# Altium schematic sheet supply.SchDoc
size A
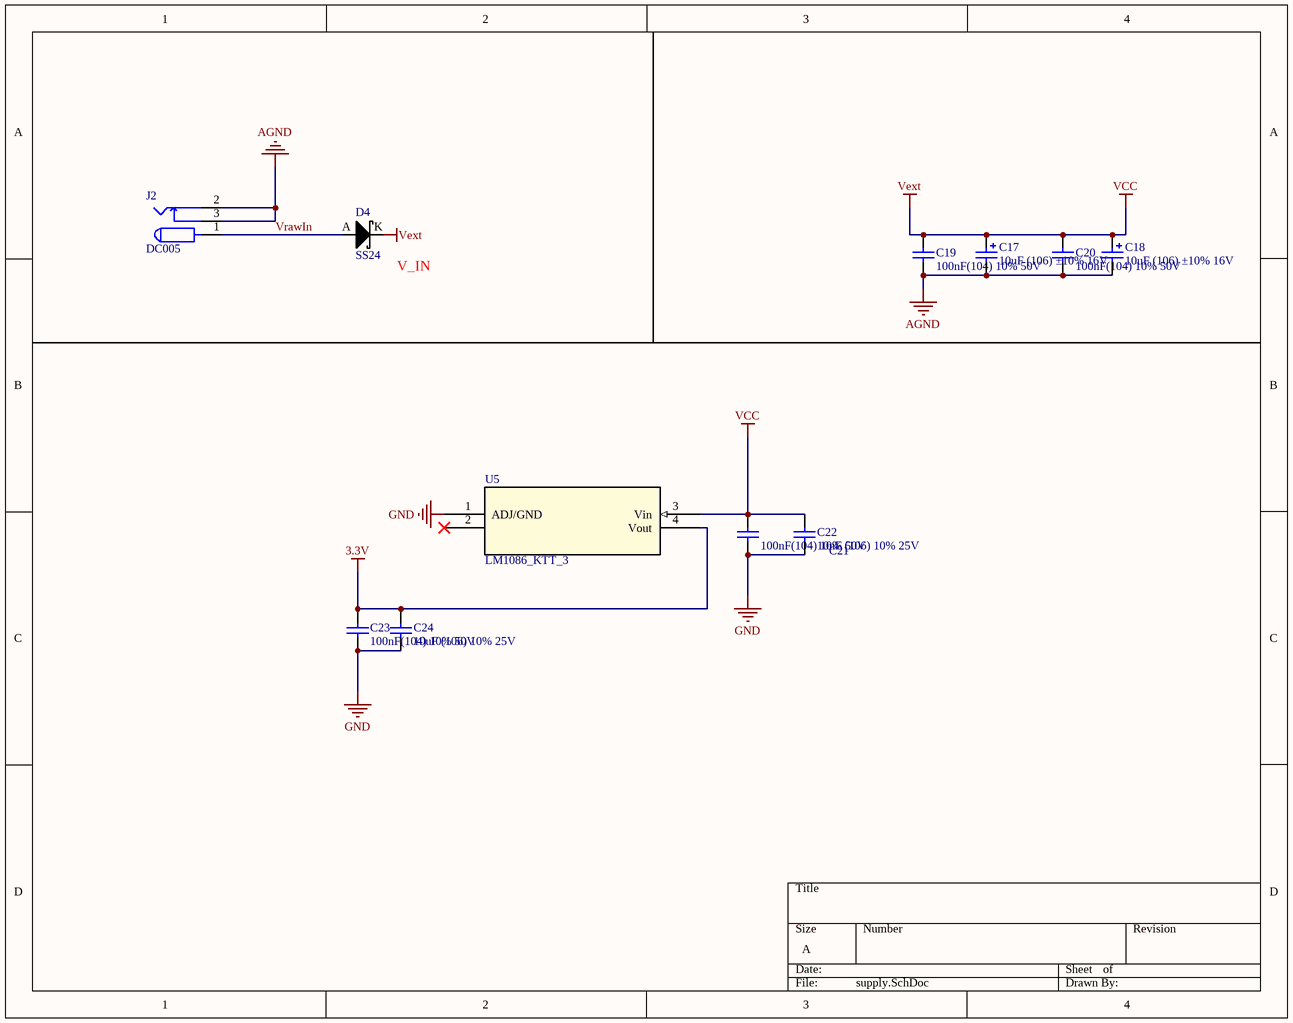
[diagram p0: supply.SchDoc]

## Parts
C17  10uF (106) ±10% 16V  [CASE-A_3216]
C18  10uF (106) ±10% 16V  [CASE-A_3216]
C19  100nF(104) 10% 50V  [0805_C]
C20  100nF(104) 10% 50V  [0805_C]
C21  100nF(104) 10% 50V  [0805_C]
C22  10uF (106) 10% 25V  [0805_C]
C23  100nF(104) 10% 50V  [0805_C]
C24  10uF (106) 10% 25V  [0805_C]
D4  SS24  [SMB-DIODE-DO214AA]
J2  DC005  [DC005]
U5  LM1086_KTT_3  [TS3B]

## Nets
3.3V: C23.1 C24.2 U5.4(Vout)
AGND: C17.2 C18.2 C19.1 C20.1 J2.2 J2.3
GND: C21.1 C22.1 C23.2 C24.1 U5.1(ADJ/GND)
VCC: C17.1 C18.1 C19.2 C20.2 C21.2 C22.2 D4.K U5.3(Vin)  [also labelled Vext]
VrawIn: D4.A J2.1

Not connected (* = marked no-connect by the designer): U5 2(Vout)*

## Notes on the sheet
- (near D4) V_IN

## Library data of the parts
C17 C18 = 3216 10uF (106) 10% 16V: 钽电容; ComponentLink1Description: 供应商链接; ComponentLink1URL: http://www.szlcsc.com/product/details_7643.html; Package: 3216; Supplier: LC; SuppliersPartNumber: C7171
C19-C21 C23 = 0805 100nF(104) 10% 50V: 贴片电容; ComponentLink1Description: 供应商链接; ComponentLink1URL: http://www.szlcsc.com/product/details_50686.html; Package: 0805; Supplier: LC; SuppliersPartNumber: C49678
C22 C24 = 0805 10uF (106) 10% 25V: 贴片电容; ComponentLink1Description: 供应商链接; ComponentLink1URL: http://www.szlcsc.com/product/details_16532.html; Package: 0805; Supplier: LC; SuppliersPartNumber: C15850
D4 = SS24: SCHOTTKY DIODE; Manufacturer: Fairchild Semiconductor; Note: 40V 2A DO214AA; Manufacturer No: SS24; Supplier: LC; PartType: SM; ROHS: True; Pin Count: 2; SuppliersPartNumber: C64881; ComponentLink1URL: https://item.szlcsc.com/65951.html
U5 = LM1086_KTT_3: Imported; PartNumber: LM1086CS-25; Comp: TypeLDO; Vendor: NationalSemiconductor; base_pn: LM1086; Symbol: NameLM1086CS-25; Library: ReferenceLM1086CS; Type: LM1086CS-2.5; Version: 1; Pin: Count3; Value: Value; RefDes: RefDes